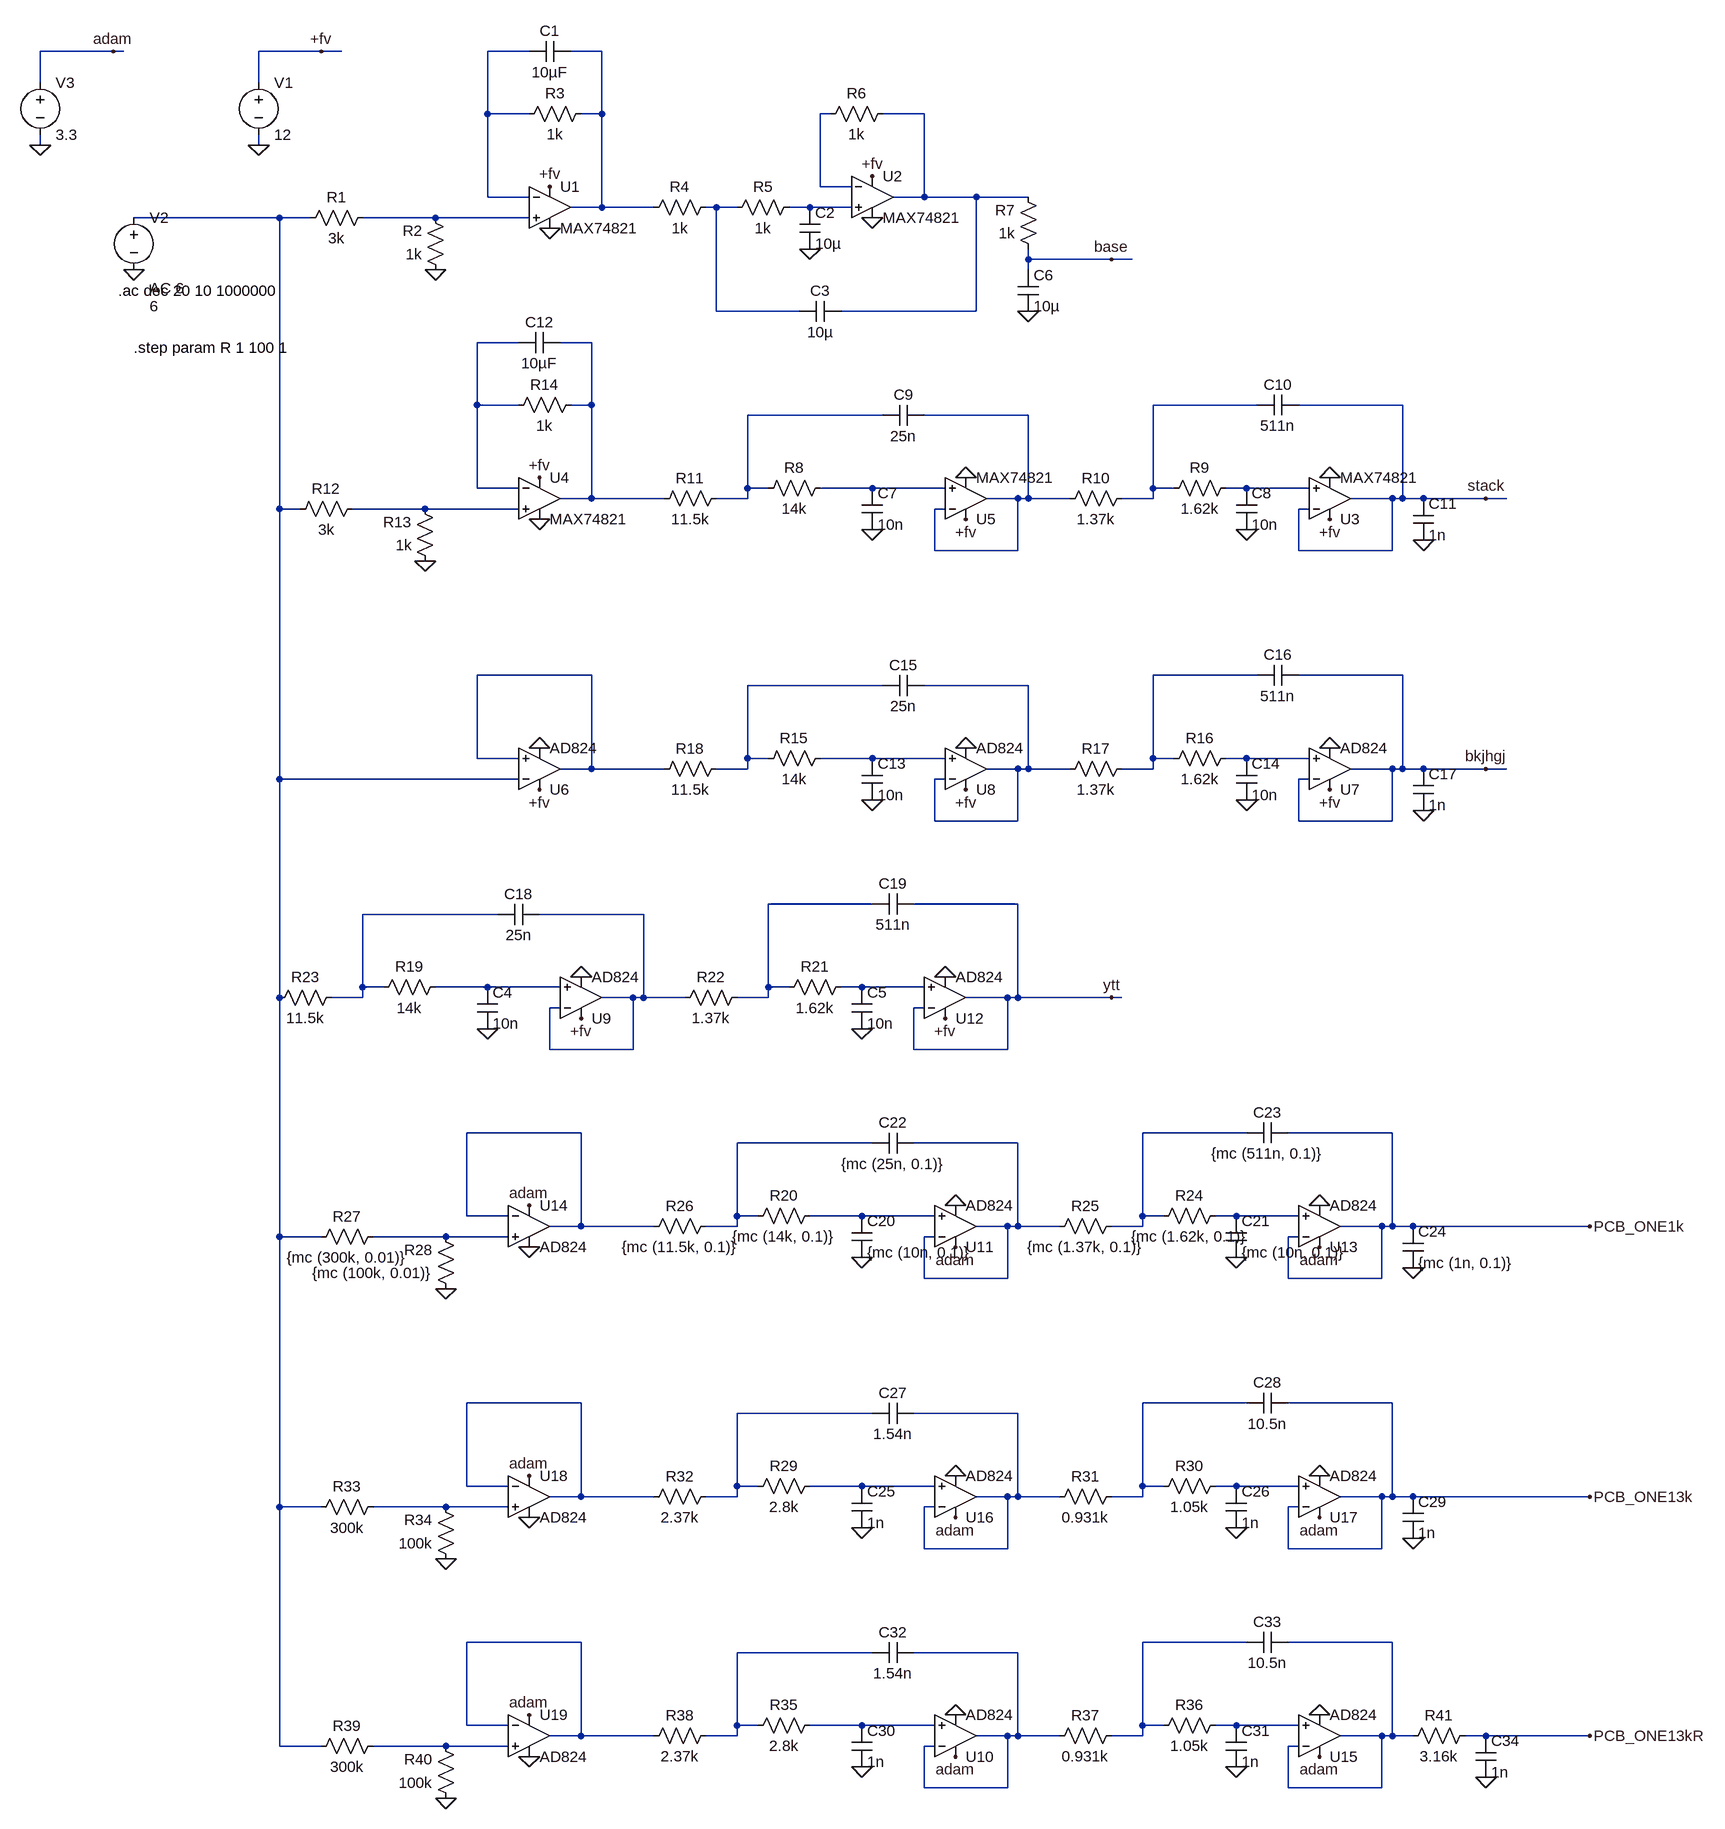
[diagram p0: schematic filters.asc]
filters.asc, the LTspice schematic file:
Version 4.1
SHEET 1 2296 2460
WIRE -176 -272 -288 -272
WIRE -160 -272 -176 -272
WIRE 144 -272 48 -272
WIRE 176 -272 144 -272
WIRE 464 -272 400 -272
WIRE 576 -272 528 -272
WIRE -288 -224 -288 -272
WIRE 48 -224 48 -272
WIRE 400 -176 400 -272
WIRE 464 -176 400 -176
WIRE 576 -176 576 -272
WIRE 576 -176 544 -176
WIRE 928 -176 912 -176
WIRE 1072 -176 1008 -176
WIRE -288 -128 -288 -144
WIRE 48 -128 48 -144
WIRE 912 -64 912 -176
WIRE 960 -64 912 -64
WIRE 400 -48 400 -176
WIRE 464 -48 400 -48
WIRE 1072 -48 1072 -176
WIRE 1072 -48 1024 -48
WIRE 1152 -48 1072 -48
WIRE 1232 -48 1152 -48
WIRE 576 -32 576 -176
WIRE 576 -32 528 -32
WIRE 656 -32 576 -32
WIRE 752 -32 736 -32
WIRE 784 -32 752 -32
WIRE 896 -32 864 -32
WIRE 960 -32 896 -32
WIRE 80 -16 -144 -16
WIRE 128 -16 80 -16
WIRE 320 -16 208 -16
WIRE 464 -16 320 -16
WIRE 1232 48 1232 32
WIRE 1360 48 1232 48
WIRE 1392 48 1360 48
WIRE 1232 64 1232 48
WIRE 752 128 752 -32
WIRE 880 128 752 128
WIRE 1152 128 1152 -48
WIRE 1152 128 944 128
WIRE 448 176 384 176
WIRE 560 176 512 176
WIRE 384 272 384 176
WIRE 448 272 384 272
WIRE 560 272 560 176
WIRE 560 272 528 272
WIRE 1584 272 1424 272
WIRE 1808 272 1648 272
WIRE 1008 288 800 288
WIRE 1232 288 1072 288
WIRE 384 400 384 272
WIRE 448 400 384 400
WIRE 800 400 800 288
WIRE 832 400 800 400
WIRE 992 400 912 400
WIRE 1104 400 992 400
WIRE 1424 400 1424 272
WIRE 1456 400 1424 400
WIRE 1568 400 1536 400
WIRE 1664 400 1568 400
WIRE 560 416 560 272
WIRE 560 416 512 416
WIRE 672 416 560 416
WIRE 800 416 800 400
WIRE 800 416 752 416
WIRE 1216 416 1168 416
WIRE 1232 416 1232 288
WIRE 1232 416 1216 416
WIRE 1296 416 1232 416
WIRE 1424 416 1424 400
WIRE 1424 416 1376 416
WIRE 1792 416 1728 416
WIRE 1808 416 1808 272
WIRE 1808 416 1792 416
WIRE 1840 416 1808 416
WIRE 1936 416 1840 416
WIRE 1968 416 1936 416
WIRE 80 432 80 -16
WIRE 112 432 80 432
WIRE 304 432 192 432
WIRE 448 432 304 432
WIRE 1104 432 1088 432
WIRE 1664 432 1648 432
WIRE 1088 496 1088 432
WIRE 1216 496 1216 416
WIRE 1216 496 1088 496
WIRE 1648 496 1648 432
WIRE 1792 496 1792 416
WIRE 1792 496 1648 496
WIRE 560 688 384 688
WIRE 1584 688 1424 688
WIRE 1808 688 1648 688
WIRE 1008 704 800 704
WIRE 1232 704 1072 704
WIRE 384 816 384 688
WIRE 448 816 384 816
WIRE 800 816 800 704
WIRE 832 816 800 816
WIRE 992 816 912 816
WIRE 1104 816 992 816
WIRE 1424 816 1424 688
WIRE 1456 816 1424 816
WIRE 1568 816 1536 816
WIRE 1664 816 1568 816
WIRE 560 832 560 688
WIRE 560 832 512 832
WIRE 672 832 560 832
WIRE 800 832 800 816
WIRE 800 832 752 832
WIRE 1216 832 1168 832
WIRE 1232 832 1232 704
WIRE 1232 832 1216 832
WIRE 1296 832 1232 832
WIRE 1424 832 1424 816
WIRE 1424 832 1376 832
WIRE 1792 832 1728 832
WIRE 1808 832 1808 688
WIRE 1808 832 1792 832
WIRE 1840 832 1808 832
WIRE 1936 832 1840 832
WIRE 1968 832 1936 832
WIRE 80 848 80 432
WIRE 448 848 80 848
WIRE 1104 848 1088 848
WIRE 1664 848 1648 848
WIRE 1088 912 1088 848
WIRE 1216 912 1216 832
WIRE 1216 912 1088 912
WIRE 1648 912 1648 848
WIRE 1792 912 1792 832
WIRE 1792 912 1648 912
WIRE 992 1040 832 1040
WIRE 1216 1040 1056 1040
WIRE 416 1056 208 1056
WIRE 640 1056 480 1056
WIRE 208 1168 208 1056
WIRE 240 1168 208 1168
WIRE 400 1168 320 1168
WIRE 512 1168 400 1168
WIRE 832 1168 832 1040
WIRE 864 1168 832 1168
WIRE 976 1168 944 1168
WIRE 1072 1168 976 1168
WIRE 80 1184 80 848
WIRE 208 1184 208 1168
WIRE 208 1184 160 1184
WIRE 624 1184 576 1184
WIRE 640 1184 640 1056
WIRE 640 1184 624 1184
WIRE 704 1184 640 1184
WIRE 832 1184 832 1168
WIRE 832 1184 784 1184
WIRE 1200 1184 1136 1184
WIRE 1216 1184 1216 1040
WIRE 1216 1184 1200 1184
WIRE 1360 1184 1216 1184
WIRE 1376 1184 1360 1184
WIRE 512 1200 496 1200
WIRE 1072 1200 1056 1200
WIRE 496 1264 496 1200
WIRE 624 1264 624 1184
WIRE 624 1264 496 1264
WIRE 1056 1264 1056 1200
WIRE 1200 1264 1200 1184
WIRE 1200 1264 1056 1264
WIRE 544 1392 368 1392
WIRE 1568 1392 1408 1392
WIRE 1792 1392 1632 1392
WIRE 992 1408 784 1408
WIRE 1216 1408 1056 1408
WIRE 368 1520 368 1392
WIRE 432 1520 368 1520
WIRE 784 1520 784 1408
WIRE 816 1520 784 1520
WIRE 976 1520 896 1520
WIRE 1088 1520 976 1520
WIRE 1408 1520 1408 1392
WIRE 1440 1520 1408 1520
WIRE 1552 1520 1520 1520
WIRE 1648 1520 1552 1520
WIRE 544 1536 544 1392
WIRE 544 1536 496 1536
WIRE 656 1536 544 1536
WIRE 784 1536 784 1520
WIRE 784 1536 736 1536
WIRE 1200 1536 1152 1536
WIRE 1216 1536 1216 1408
WIRE 1216 1536 1200 1536
WIRE 1280 1536 1216 1536
WIRE 1408 1536 1408 1520
WIRE 1408 1536 1360 1536
WIRE 1776 1536 1712 1536
WIRE 1792 1536 1792 1392
WIRE 1792 1536 1776 1536
WIRE 1824 1536 1792 1536
WIRE 2096 1536 1824 1536
WIRE 80 1552 80 1184
WIRE 144 1552 80 1552
WIRE 336 1552 224 1552
WIRE 432 1552 336 1552
WIRE 1088 1552 1072 1552
WIRE 1648 1552 1632 1552
WIRE 1072 1616 1072 1552
WIRE 1200 1616 1200 1536
WIRE 1200 1616 1072 1616
WIRE 1632 1616 1632 1552
WIRE 1776 1616 1776 1536
WIRE 1776 1616 1632 1616
WIRE 544 1808 368 1808
WIRE 1568 1808 1408 1808
WIRE 1792 1808 1632 1808
WIRE 992 1824 784 1824
WIRE 1216 1824 1056 1824
WIRE 368 1936 368 1808
WIRE 432 1936 368 1936
WIRE 784 1936 784 1824
WIRE 816 1936 784 1936
WIRE 976 1936 896 1936
WIRE 1088 1936 976 1936
WIRE 1408 1936 1408 1808
WIRE 1440 1936 1408 1936
WIRE 1552 1936 1520 1936
WIRE 1648 1936 1552 1936
WIRE 544 1952 544 1808
WIRE 544 1952 496 1952
WIRE 656 1952 544 1952
WIRE 784 1952 784 1936
WIRE 784 1952 736 1952
WIRE 1200 1952 1152 1952
WIRE 1216 1952 1216 1824
WIRE 1216 1952 1200 1952
WIRE 1280 1952 1216 1952
WIRE 1408 1952 1408 1936
WIRE 1408 1952 1360 1952
WIRE 1776 1952 1712 1952
WIRE 1792 1952 1792 1808
WIRE 1792 1952 1776 1952
WIRE 1824 1952 1792 1952
WIRE 2096 1952 1824 1952
WIRE 80 1968 80 1552
WIRE 144 1968 80 1968
WIRE 336 1968 224 1968
WIRE 432 1968 336 1968
WIRE 1088 1968 1072 1968
WIRE 1648 1968 1632 1968
WIRE 1072 2032 1072 1968
WIRE 1200 2032 1200 1952
WIRE 1200 2032 1072 2032
WIRE 1632 2032 1632 1968
WIRE 1776 2032 1776 1952
WIRE 1776 2032 1632 2032
WIRE 544 2176 368 2176
WIRE 1568 2176 1408 2176
WIRE 1792 2176 1632 2176
WIRE 992 2192 784 2192
WIRE 1216 2192 1056 2192
WIRE 368 2304 368 2176
WIRE 432 2304 368 2304
WIRE 784 2304 784 2192
WIRE 816 2304 784 2304
WIRE 976 2304 896 2304
WIRE 1088 2304 976 2304
WIRE 1408 2304 1408 2176
WIRE 1440 2304 1408 2304
WIRE 1552 2304 1520 2304
WIRE 1648 2304 1552 2304
WIRE 544 2320 544 2176
WIRE 544 2320 496 2320
WIRE 656 2320 544 2320
WIRE 784 2320 784 2304
WIRE 784 2320 736 2320
WIRE 1200 2320 1152 2320
WIRE 1216 2320 1216 2192
WIRE 1216 2320 1200 2320
WIRE 1280 2320 1216 2320
WIRE 1408 2320 1408 2304
WIRE 1408 2320 1360 2320
WIRE 1776 2320 1712 2320
WIRE 1792 2320 1792 2176
WIRE 1792 2320 1776 2320
WIRE 1824 2320 1792 2320
WIRE 1936 2320 1904 2320
WIRE 2096 2320 1936 2320
WIRE 80 2336 80 1968
WIRE 144 2336 80 2336
WIRE 336 2336 224 2336
WIRE 432 2336 336 2336
WIRE 1088 2336 1072 2336
WIRE 1648 2336 1632 2336
WIRE 1072 2400 1072 2336
WIRE 1200 2400 1200 2320
WIRE 1200 2400 1072 2400
WIRE 1632 2400 1632 2336
WIRE 1776 2400 1776 2320
WIRE 1776 2400 1632 2400
FLAG 48 -128 0
FLAG 144 -272 +fv
FLAG 496 0 0
FLAG 496 -64 +fv
FLAG -144 64 0
FLAG 992 -16 0
FLAG 992 -80 +fv
FLAG 320 64 0
FLAG 1232 128 0
FLAG 896 32 0
FLAG 1360 48 base
FLAG 992 464 0
FLAG 1568 464 0
FLAG 1840 480 0
FLAG 1136 384 0
FLAG 1136 448 +fv
FLAG 1696 384 0
FLAG 1696 448 +fv
FLAG 480 448 0
FLAG 480 384 +fv
FLAG 304 512 0
FLAG 1936 416 stack
FLAG 992 880 0
FLAG 1568 880 0
FLAG 1840 896 0
FLAG 1136 800 0
FLAG 1136 864 +fv
FLAG 1696 800 0
FLAG 1696 864 +fv
FLAG 1936 832 bkjhgj
FLAG 400 1232 0
FLAG 976 1232 0
FLAG 544 1152 0
FLAG 544 1216 +fv
FLAG 1104 1152 0
FLAG 1104 1216 +fv
FLAG 1360 1184 ytt
FLAG 480 864 +fv
FLAG 480 800 0
FLAG 976 1584 0
FLAG 1552 1584 0
FLAG 1824 1600 0
FLAG 1120 1504 0
FLAG 1680 1504 0
FLAG -288 -128 0
FLAG -176 -272 adam
FLAG 464 1504 adam
FLAG 1120 1568 adam
FLAG 1680 1568 adam
FLAG 464 1568 0
FLAG 336 1632 0
FLAG 2096 1536 PCB_ONE1k
FLAG 976 2000 0
FLAG 1552 2000 0
FLAG 1824 2016 0
FLAG 1120 1920 0
FLAG 1680 1920 0
FLAG 464 1920 adam
FLAG 1120 1984 adam
FLAG 1680 1984 adam
FLAG 464 1984 0
FLAG 336 2048 0
FLAG 2096 1952 PCB_ONE13k
FLAG 976 2368 0
FLAG 1552 2368 0
FLAG 1936 2384 0
FLAG 1120 2288 0
FLAG 1680 2288 0
FLAG 464 2288 adam
FLAG 1120 2352 adam
FLAG 1680 2352 adam
FLAG 464 2352 0
FLAG 336 2416 0
FLAG 2096 2320 PCB_ONE13kR
SYMBOL OpAmps\\MAX74821 496 -96 R0
SYMATTR InstName U1
SYMBOL voltage 48 -240 R0
WINDOW 123 0 0 Left 0
WINDOW 39 0 0 Left 0
SYMATTR InstName V1
SYMATTR Value 12
SYMBOL voltage -144 -32 R0
WINDOW 123 24 124 Left 2
WINDOW 39 0 0 Left 0
WINDOW 3 24 152 Left 2
SYMATTR Value2 AC 6
SYMATTR Value 6
SYMATTR InstName V2
SYMBOL res 224 -32 R90
WINDOW 0 0 56 VBottom 2
WINDOW 3 32 56 VTop 2
SYMATTR InstName R1
SYMATTR Value 3k
SYMBOL res 336 80 R180
WINDOW 0 36 76 Left 2
WINDOW 3 36 40 Left 2
SYMATTR InstName R2
SYMATTR Value 1k
SYMBOL res 560 -192 R90
WINDOW 0 0 56 VBottom 2
WINDOW 3 32 56 VTop 2
SYMATTR InstName R3
SYMATTR Value 1k
SYMBOL cap 528 -288 R90
WINDOW 0 0 32 VBottom 2
WINDOW 3 32 32 VTop 2
SYMATTR InstName C1
SYMATTR Value 10µF
SYMBOL res 752 -48 R90
WINDOW 0 0 56 VBottom 2
WINDOW 3 32 56 VTop 2
SYMATTR InstName R4
SYMATTR Value 1k
SYMBOL res 880 -48 R90
WINDOW 0 0 56 VBottom 2
WINDOW 3 32 56 VTop 2
SYMATTR InstName R5
SYMATTR Value 1k
SYMBOL OpAmps\\MAX74821 992 -112 R0
SYMATTR InstName U2
SYMBOL cap 880 -32 R0
SYMATTR InstName C2
SYMATTR Value 10µ
SYMBOL cap 944 112 R90
WINDOW 0 0 32 VBottom 2
WINDOW 3 32 32 VTop 2
SYMATTR InstName C3
SYMATTR Value 10µ
SYMBOL res 1024 -192 R90
WINDOW 0 0 56 VBottom 2
WINDOW 3 32 56 VTop 2
SYMATTR InstName R6
SYMATTR Value 1k
SYMBOL res 1248 48 R180
WINDOW 0 36 76 Left 2
WINDOW 3 36 40 Left 2
SYMATTR InstName R7
SYMATTR Value 1k
SYMBOL cap 1216 64 R0
SYMATTR InstName C6
SYMATTR Value 10µ
SYMBOL cap 976 400 R0
SYMATTR InstName C7
SYMATTR Value 10n
SYMBOL cap 1552 400 R0
SYMATTR InstName C8
SYMATTR Value 10n
SYMBOL res 928 384 R90
WINDOW 0 0 56 VBottom 2
WINDOW 3 32 56 VTop 2
SYMATTR InstName R8
SYMATTR Value 14k
SYMBOL res 1552 384 R90
WINDOW 0 0 56 VBottom 2
WINDOW 3 32 56 VTop 2
SYMATTR InstName R9
SYMATTR Value 1.62k
SYMBOL res 1392 400 R90
WINDOW 0 0 56 VBottom 2
WINDOW 3 32 56 VTop 2
SYMATTR InstName R10
SYMATTR Value 1.37k
SYMBOL cap 1072 272 R90
WINDOW 0 0 32 VBottom 2
WINDOW 3 32 32 VTop 2
SYMATTR InstName C9
SYMATTR Value 25n
SYMBOL cap 1648 256 R90
WINDOW 0 0 32 VBottom 2
WINDOW 3 32 32 VTop 2
SYMATTR InstName C10
SYMATTR Value 511n
SYMBOL res 768 400 R90
WINDOW 0 0 56 VBottom 2
WINDOW 3 32 56 VTop 2
SYMATTR InstName R11
SYMATTR Value 11.5k
SYMBOL cap 1824 416 R0
SYMATTR InstName C11
SYMATTR Value 1n
SYMBOL OpAmps\\MAX74821 1136 480 M180
SYMATTR InstName U5
SYMBOL OpAmps\\MAX74821 1696 480 M180
SYMATTR InstName U3
SYMBOL OpAmps\\MAX74821 480 352 R0
SYMATTR InstName U4
SYMBOL res 208 416 R90
WINDOW 0 0 56 VBottom 2
WINDOW 3 32 56 VTop 2
SYMATTR InstName R12
SYMATTR Value 3k
SYMBOL res 320 528 R180
WINDOW 0 36 76 Left 2
WINDOW 3 36 40 Left 2
SYMATTR InstName R13
SYMATTR Value 1k
SYMBOL res 544 256 R90
WINDOW 0 0 56 VBottom 2
WINDOW 3 32 56 VTop 2
SYMATTR InstName R14
SYMATTR Value 1k
SYMBOL cap 512 160 R90
WINDOW 0 0 32 VBottom 2
WINDOW 3 32 32 VTop 2
SYMATTR InstName C12
SYMATTR Value 10µF
SYMBOL cap 976 816 R0
SYMATTR InstName C13
SYMATTR Value 10n
SYMBOL cap 1552 816 R0
SYMATTR InstName C14
SYMATTR Value 10n
SYMBOL res 928 800 R90
WINDOW 0 0 56 VBottom 2
WINDOW 3 32 56 VTop 2
SYMATTR InstName R15
SYMATTR Value 14k
SYMBOL res 1552 800 R90
WINDOW 0 0 56 VBottom 2
WINDOW 3 32 56 VTop 2
SYMATTR InstName R16
SYMATTR Value 1.62k
SYMBOL res 1392 816 R90
WINDOW 0 0 56 VBottom 2
WINDOW 3 32 56 VTop 2
SYMATTR InstName R17
SYMATTR Value 1.37k
SYMBOL cap 1072 688 R90
WINDOW 0 0 32 VBottom 2
WINDOW 3 32 32 VTop 2
SYMATTR InstName C15
SYMATTR Value 25n
SYMBOL cap 1648 672 R90
WINDOW 0 0 32 VBottom 2
WINDOW 3 32 32 VTop 2
SYMATTR InstName C16
SYMATTR Value 511n
SYMBOL res 768 816 R90
WINDOW 0 0 56 VBottom 2
WINDOW 3 32 56 VTop 2
SYMATTR InstName R18
SYMATTR Value 11.5k
SYMBOL cap 1824 832 R0
SYMATTR InstName C17
SYMATTR Value 1n
SYMBOL cap 384 1168 R0
SYMATTR InstName C4
SYMATTR Value 10n
SYMBOL cap 960 1168 R0
SYMATTR InstName C5
SYMATTR Value 10n
SYMBOL res 336 1152 R90
WINDOW 0 0 56 VBottom 2
WINDOW 3 32 56 VTop 2
SYMATTR InstName R19
SYMATTR Value 14k
SYMBOL res 960 1152 R90
WINDOW 0 0 56 VBottom 2
WINDOW 3 32 56 VTop 2
SYMATTR InstName R21
SYMATTR Value 1.62k
SYMBOL res 800 1168 R90
WINDOW 0 0 56 VBottom 2
WINDOW 3 32 56 VTop 2
SYMATTR InstName R22
SYMATTR Value 1.37k
SYMBOL cap 480 1040 R90
WINDOW 0 0 32 VBottom 2
WINDOW 3 32 32 VTop 2
SYMATTR InstName C18
SYMATTR Value 25n
SYMBOL cap 1056 1024 R90
WINDOW 0 0 32 VBottom 2
WINDOW 3 32 32 VTop 2
SYMATTR InstName C19
SYMATTR Value 511n
SYMBOL res 176 1168 R90
WINDOW 0 0 56 VBottom 2
WINDOW 3 32 56 VTop 2
SYMATTR InstName R23
SYMATTR Value 11.5k
SYMBOL OpAmps\\AD824 1104 1248 M180
SYMATTR InstName U12
SYMBOL OpAmps\\AD824 544 1248 M180
SYMATTR InstName U9
SYMBOL OpAmps\\AD824 480 896 M180
SYMATTR InstName U6
SYMBOL OpAmps\\AD824 1136 896 M180
SYMATTR InstName U8
SYMBOL OpAmps\\AD824 1696 896 M180
SYMATTR InstName U7
SYMBOL cap 960 1520 R0
SYMATTR InstName C20
SYMATTR Value {mc (10n, 0.1)}
SYMBOL cap 1536 1520 R0
SYMATTR InstName C21
SYMATTR Value {mc (10n, 0.1)}
SYMBOL res 912 1504 R90
WINDOW 0 0 56 VBottom 2
WINDOW 3 32 56 VTop 2
SYMATTR InstName R20
SYMATTR Value {mc (14k, 0.1)}
SYMBOL res 1536 1504 R90
WINDOW 0 0 56 VBottom 2
WINDOW 3 32 56 VTop 2
SYMATTR InstName R24
SYMATTR Value {mc (1.62k, 0.1)}
SYMBOL res 1376 1520 R90
WINDOW 0 0 56 VBottom 2
WINDOW 3 32 56 VTop 2
SYMATTR InstName R25
SYMATTR Value {mc (1.37k, 0.1)}
SYMBOL cap 1056 1392 R90
WINDOW 0 0 32 VBottom 2
WINDOW 3 32 32 VTop 2
SYMATTR InstName C22
SYMATTR Value {mc (25n, 0.1)}
SYMBOL cap 1632 1376 R90
WINDOW 0 0 32 VBottom 2
WINDOW 3 32 32 VTop 2
SYMATTR InstName C23
SYMATTR Value {mc (511n, 0.1)}
SYMBOL res 752 1520 R90
WINDOW 0 0 56 VBottom 2
WINDOW 3 32 56 VTop 2
SYMATTR InstName R26
SYMATTR Value {mc (11.5k, 0.1)}
SYMBOL cap 1808 1536 R0
SYMATTR InstName C24
SYMATTR Value {mc (1n, 0.1)}
SYMBOL OpAmps\\AD824 1120 1600 M180
SYMATTR InstName U11
SYMBOL OpAmps\\AD824 1680 1600 M180
SYMATTR InstName U13
SYMBOL voltage -288 -240 R0
WINDOW 123 0 0 Left 0
WINDOW 39 0 0 Left 0
SYMATTR InstName V3
SYMATTR Value 3.3
SYMBOL OpAmps\\AD824 464 1472 R0
SYMATTR InstName U14
SYMBOL res 240 1536 R90
WINDOW 0 0 56 VBottom 2
WINDOW 3 32 56 VTop 2
SYMATTR InstName R27
SYMATTR Value {mc (300k, 0.01)}
SYMBOL res 352 1648 R180
WINDOW 0 36 76 Left 2
WINDOW 3 36 40 Left 2
SYMATTR InstName R28
SYMATTR Value {mc (100k, 0.01)}
SYMBOL cap 960 1936 R0
SYMATTR InstName C25
SYMATTR Value 1n
SYMBOL cap 1536 1936 R0
SYMATTR InstName C26
SYMATTR Value 1n
SYMBOL res 912 1920 R90
WINDOW 0 0 56 VBottom 2
WINDOW 3 32 56 VTop 2
SYMATTR InstName R29
SYMATTR Value 2.8k
SYMBOL res 1536 1920 R90
WINDOW 0 0 56 VBottom 2
WINDOW 3 32 56 VTop 2
SYMATTR InstName R30
SYMATTR Value 1.05k
SYMBOL res 1376 1936 R90
WINDOW 0 0 56 VBottom 2
WINDOW 3 32 56 VTop 2
SYMATTR InstName R31
SYMATTR Value 0.931k
SYMBOL cap 1056 1808 R90
WINDOW 0 0 32 VBottom 2
WINDOW 3 32 32 VTop 2
SYMATTR InstName C27
SYMATTR Value 1.54n
SYMBOL cap 1632 1792 R90
WINDOW 0 0 32 VBottom 2
WINDOW 3 32 32 VTop 2
SYMATTR InstName C28
SYMATTR Value 10.5n
SYMBOL res 752 1936 R90
WINDOW 0 0 56 VBottom 2
WINDOW 3 32 56 VTop 2
SYMATTR InstName R32
SYMATTR Value 2.37k
SYMBOL cap 1808 1952 R0
SYMATTR InstName C29
SYMATTR Value 1n
SYMBOL OpAmps\\AD824 1120 2016 M180
SYMATTR InstName U16
SYMBOL OpAmps\\AD824 1680 2016 M180
SYMATTR InstName U17
SYMBOL OpAmps\\AD824 464 1888 R0
SYMATTR InstName U18
SYMBOL res 240 1952 R90
WINDOW 0 0 56 VBottom 2
WINDOW 3 32 56 VTop 2
SYMATTR InstName R33
SYMATTR Value 300k
SYMBOL res 352 2064 R180
WINDOW 0 36 76 Left 2
WINDOW 3 36 40 Left 2
SYMATTR InstName R34
SYMATTR Value 100k
SYMBOL cap 960 2304 R0
SYMATTR InstName C30
SYMATTR Value 1n
SYMBOL cap 1536 2304 R0
SYMATTR InstName C31
SYMATTR Value 1n
SYMBOL res 912 2288 R90
WINDOW 0 0 56 VBottom 2
WINDOW 3 32 56 VTop 2
SYMATTR InstName R35
SYMATTR Value 2.8k
SYMBOL res 1536 2288 R90
WINDOW 0 0 56 VBottom 2
WINDOW 3 32 56 VTop 2
SYMATTR InstName R36
SYMATTR Value 1.05k
SYMBOL res 1376 2304 R90
WINDOW 0 0 56 VBottom 2
WINDOW 3 32 56 VTop 2
SYMATTR InstName R37
SYMATTR Value 0.931k
SYMBOL cap 1056 2176 R90
WINDOW 0 0 32 VBottom 2
WINDOW 3 32 32 VTop 2
SYMATTR InstName C32
SYMATTR Value 1.54n
SYMBOL cap 1632 2160 R90
WINDOW 0 0 32 VBottom 2
WINDOW 3 32 32 VTop 2
SYMATTR InstName C33
SYMATTR Value 10.5n
SYMBOL res 752 2304 R90
WINDOW 0 0 56 VBottom 2
WINDOW 3 32 56 VTop 2
SYMATTR InstName R38
SYMATTR Value 2.37k
SYMBOL cap 1920 2320 R0
SYMATTR InstName C34
SYMATTR Value 1n
SYMBOL OpAmps\\AD824 1120 2384 M180
SYMATTR InstName U10
SYMBOL OpAmps\\AD824 1680 2384 M180
SYMATTR InstName U15
SYMBOL OpAmps\\AD824 464 2256 R0
SYMATTR InstName U19
SYMBOL res 240 2320 R90
WINDOW 0 0 56 VBottom 2
WINDOW 3 32 56 VTop 2
SYMATTR InstName R39
SYMATTR Value 300k
SYMBOL res 352 2432 R180
WINDOW 0 36 76 Left 2
WINDOW 3 36 40 Left 2
SYMATTR InstName R40
SYMATTR Value 100k
SYMBOL res 1920 2304 R90
WINDOW 0 0 56 VBottom 2
WINDOW 3 32 56 VTop 2
SYMATTR InstName R41
SYMATTR Value 3.16k
TEXT -168 96 Left 2 !.ac dec 20 10 1000000
TEXT -144 184 Left 2 !.step param R 1 100 1

The netlist it stands for:
* filters.asc
X§U1 N008 N001 +fv 0 N002 MAX74821  ; pins In+ In- V+ V- OUT
V1 +fv 0 12
V2 N007 0 6 AC 6
R1 N008 N007 3k
R2 0 N008 1k
R3 N002 N001 1k
C1 N002 N001 10µF
R4 N005 N002 1k
R5 N006 N005 1k
X§U2 N006 N003 +fv 0 N004 MAX74821  ; pins In+ In- V+ V- OUT
C2 N006 0 10µ
C3 N004 N005 10µ
R6 N004 N003 1k
R7 base N004 1k
C6 base 0 10µ
C7 N014 0 10n
C8 N015 0 10n
R8 N014 N012 14k
R9 N015 N011 1.62k
R10 N011 N013 1.37k
C9 N013 N012 25n
C10 stack N011 511n
R11 N012 N010 11.5k
C11 stack 0 1n
X§U5 N014 N013 +fv 0 N013 MAX74821  ; pins In+ In- V+ V- OUT
X§U3 N015 stack +fv 0 stack MAX74821  ; pins In+ In- V+ V- OUT
X§U4 N016 N009 +fv 0 N010 MAX74821  ; pins In+ In- V+ V- OUT
R12 N016 N007 3k
R13 0 N016 1k
R14 N010 N009 1k
C12 N010 N009 10µF
C13 N021 0 10n
C14 N022 0 10n
R15 N021 N019 14k
R16 N022 N018 1.62k
R17 N018 N020 1.37k
C15 N020 N019 25n
C16 bkjhgj N018 511n
R18 N019 N017 11.5k
C17 bkjhgj 0 1n
C4 N026 0 10n
C5 N027 0 10n
R19 N026 N024 14k
R21 N027 N023 1.62k
R22 N023 N025 1.37k
C18 N025 N024 25n
C19 ytt N023 511n
R23 N024 N007 11.5k
X§U12 N027 ytt +fv 0 ytt AD824  ; pins In+ In- V+ V- OUT
X§U9 N026 N025 +fv 0 N025 AD824  ; pins In+ In- V+ V- OUT
X§U6 N017 N007 +fv 0 N017 AD824  ; pins In+ In- V+ V- OUT
X§U8 N021 N020 +fv 0 N020 AD824  ; pins In+ In- V+ V- OUT
X§U7 N022 bkjhgj +fv 0 bkjhgj AD824  ; pins In+ In- V+ V- OUT
C20 N032 0 {mc (10n, 0.1)}
C21 N033 0 {mc (10n, 0.1)}
R20 N032 N030 {mc (14k, 0.1)}
R24 N033 N029 {mc (1.62k, 0.1)}
R25 N029 N031 {mc (1.37k, 0.1)}
C22 N031 N030 {mc (25n, 0.1)}
C23 PCB_ONE1k N029 {mc (511n, 0.1)}
R26 N030 N028 {mc (11.5k, 0.1)}
C24 PCB_ONE1k 0 {mc (1n, 0.1)}
X§U11 N032 N031 adam 0 N031 AD824  ; pins In+ In- V+ V- OUT
X§U13 N033 PCB_ONE1k adam 0 PCB_ONE1k AD824  ; pins In+ In- V+ V- OUT
V3 adam 0 3.3
X§U14 N034 N028 adam 0 N028 AD824  ; pins In+ In- V+ V- OUT
R27 N034 N007 {mc (300k, 0.01)}
R28 0 N034 {mc (100k, 0.01)}
C25 N039 0 1n
C26 N040 0 1n
R29 N039 N037 2.8k
R30 N040 N036 1.05k
R31 N036 N038 0.931k
C27 N038 N037 1.54n
C28 PCB_ONE13k N036 10.5n
R32 N037 N035 2.37k
C29 PCB_ONE13k 0 1n
X§U16 N039 N038 adam 0 N038 AD824  ; pins In+ In- V+ V- OUT
X§U17 N040 PCB_ONE13k adam 0 PCB_ONE13k AD824  ; pins In+ In- V+ V- OUT
X§U18 N041 N035 adam 0 N035 AD824  ; pins In+ In- V+ V- OUT
R33 N041 N007 300k
R34 0 N041 100k
C30 N047 0 1n
C31 N048 0 1n
R35 N047 N045 2.8k
R36 N048 N043 1.05k
R37 N043 N046 0.931k
C32 N046 N045 1.54n
C33 N044 N043 10.5n
R38 N045 N042 2.37k
C34 PCB_ONE13kR 0 1n
X§U10 N047 N046 adam 0 N046 AD824  ; pins In+ In- V+ V- OUT
X§U15 N048 N044 adam 0 N044 AD824  ; pins In+ In- V+ V- OUT
X§U19 N049 N042 adam 0 N042 AD824  ; pins In+ In- V+ V- OUT
R39 N049 N007 300k
R40 0 N049 100k
R41 PCB_ONE13kR N044 3.16k
.ac dec 20 10 1000000
.step param R 1 100 1
.backanno
.end